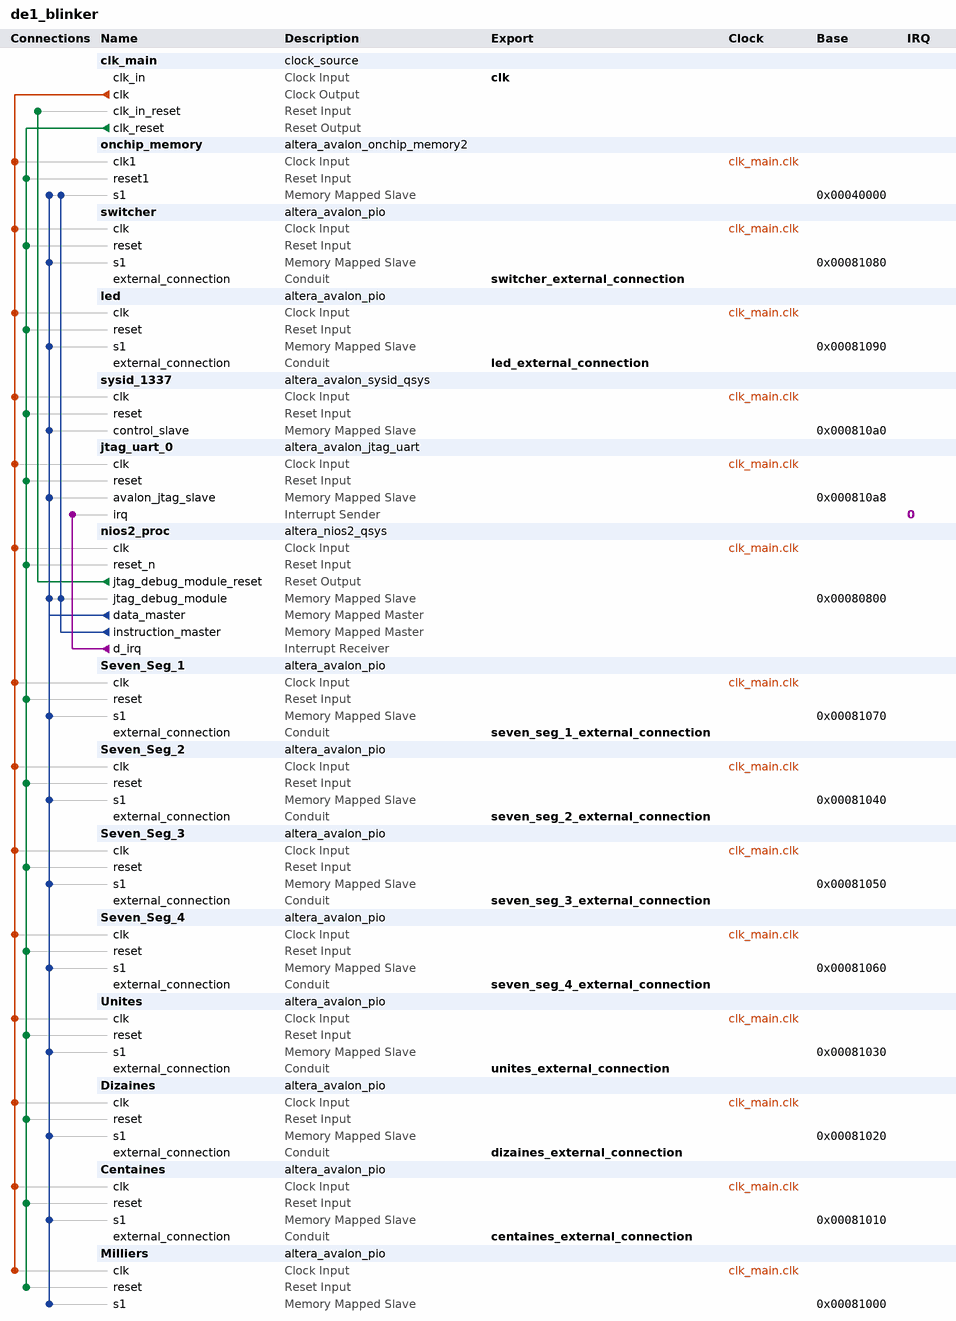
[diagram p0: system contents]
# Platform Designer (Qsys) system de1_blinker, Cyclone V 5CSEBA6U23I7
# Parameters at their usual value, and those the tool derives, are not listed.
package require -exact qsys 15.0
create_system de1_blinker
set_project_property DEVICE_FAMILY {Cyclone V}
set_project_property DEVICE 5CSEBA6U23I7

add_instance clk_main clock_source 15.0
set_instance_parameter_value clk_main clockFrequency 50000000

add_instance onchip_memory altera_avalon_onchip_memory2 15.0
set_instance_parameter_value onchip_memory dataWidth 32
set_instance_parameter_value onchip_memory dualPort false
set_instance_parameter_value onchip_memory initMemContent true
set_instance_parameter_value onchip_memory initializationFileName onchip_mem.hex
set_instance_parameter_value onchip_memory memorySize 200000

add_instance switcher altera_avalon_pio 15.0
set_instance_parameter_value switcher direction Input
set_instance_parameter_value switcher width 4

add_instance led altera_avalon_pio 15.0
set_instance_parameter_value led direction Output
set_instance_parameter_value led width 8

add_instance sysid_1337 altera_avalon_sysid_qsys 15.0
set_instance_parameter_value sysid_1337 id 4919

add_instance jtag_uart_0 altera_avalon_jtag_uart 15.0
set_instance_parameter_value jtag_uart_0 simInteractiveOptions NO_INTERACTIVE_WINDOWS

add_instance nios2_proc altera_nios2_qsys 15.0
set_instance_parameter_value nios2_proc breakSlave nios2_proc.jtag_debug_module
set_instance_parameter_value nios2_proc exceptionSlave onchip_memory.s1
set_instance_parameter_value nios2_proc icache_size 4096
set_instance_parameter_value nios2_proc impl Tiny
set_instance_parameter_value nios2_proc mmu_TLBMissExcSlave None
set_instance_parameter_value nios2_proc resetSlave onchip_memory.s1
set_instance_parameter_value nios2_proc resetrequest_enabled true

add_instance Seven_Seg_1 altera_avalon_pio 15.0
set_instance_parameter_value Seven_Seg_1 direction Output
set_instance_parameter_value Seven_Seg_1 width 8

add_instance Seven_Seg_2 altera_avalon_pio 15.0
set_instance_parameter_value Seven_Seg_2 direction Output
set_instance_parameter_value Seven_Seg_2 width 8

add_instance Seven_Seg_3 altera_avalon_pio 15.0
set_instance_parameter_value Seven_Seg_3 direction Output
set_instance_parameter_value Seven_Seg_3 width 8

add_instance Seven_Seg_4 altera_avalon_pio 15.0
set_instance_parameter_value Seven_Seg_4 direction Output
set_instance_parameter_value Seven_Seg_4 width 8

add_instance Unites altera_avalon_pio 15.0
set_instance_parameter_value Unites direction Input
set_instance_parameter_value Unites width 4

add_instance Dizaines altera_avalon_pio 15.0
set_instance_parameter_value Dizaines direction Input
set_instance_parameter_value Dizaines width 4

add_instance Centaines altera_avalon_pio 15.0
set_instance_parameter_value Centaines direction Input
set_instance_parameter_value Centaines width 4

add_instance Milliers altera_avalon_pio 15.0
set_instance_parameter_value Milliers direction Input
set_instance_parameter_value Milliers width 4

# connections
add_connection clk_main.clk Centaines.clk clock
add_connection clk_main.clk Dizaines.clk clock
add_connection clk_main.clk jtag_uart_0.clk clock
add_connection clk_main.clk led.clk clock
add_connection clk_main.clk Milliers.clk clock
add_connection clk_main.clk nios2_proc.clk clock
add_connection clk_main.clk onchip_memory.clk1 clock
add_connection clk_main.clk Seven_Seg_1.clk clock
add_connection clk_main.clk Seven_Seg_2.clk clock
add_connection clk_main.clk Seven_Seg_3.clk clock
add_connection clk_main.clk Seven_Seg_4.clk clock
add_connection clk_main.clk switcher.clk clock
add_connection clk_main.clk sysid_1337.clk clock
add_connection clk_main.clk Unites.clk clock
add_connection clk_main.clk_reset Centaines.reset reset
add_connection clk_main.clk_reset Dizaines.reset reset
add_connection clk_main.clk_reset jtag_uart_0.reset reset
add_connection clk_main.clk_reset led.reset reset
add_connection clk_main.clk_reset Milliers.reset reset
add_connection clk_main.clk_reset nios2_proc.reset_n reset
add_connection clk_main.clk_reset onchip_memory.reset1 reset
add_connection clk_main.clk_reset Seven_Seg_1.reset reset
add_connection clk_main.clk_reset Seven_Seg_2.reset reset
add_connection clk_main.clk_reset Seven_Seg_3.reset reset
add_connection clk_main.clk_reset Seven_Seg_4.reset reset
add_connection clk_main.clk_reset switcher.reset reset
add_connection clk_main.clk_reset sysid_1337.reset reset
add_connection clk_main.clk_reset Unites.reset reset
add_connection nios2_proc.jtag_debug_module_reset clk_main.clk_in_reset reset
add_connection nios2_proc.data_master Centaines.s1 avalon
set_connection_parameter_value nios2_proc.data_master/Centaines.s1 baseAddress 0x00081010
add_connection nios2_proc.data_master Dizaines.s1 avalon
set_connection_parameter_value nios2_proc.data_master/Dizaines.s1 baseAddress 0x00081020
add_connection nios2_proc.data_master jtag_uart_0.avalon_jtag_slave avalon
set_connection_parameter_value nios2_proc.data_master/jtag_uart_0.avalon_jtag_slave baseAddress 0x000810a8
add_connection nios2_proc.data_master led.s1 avalon
set_connection_parameter_value nios2_proc.data_master/led.s1 baseAddress 0x00081090
add_connection nios2_proc.data_master Milliers.s1 avalon
set_connection_parameter_value nios2_proc.data_master/Milliers.s1 baseAddress 0x00081000
add_connection nios2_proc.data_master nios2_proc.jtag_debug_module avalon
set_connection_parameter_value nios2_proc.data_master/nios2_proc.jtag_debug_module baseAddress 0x00080800
add_connection nios2_proc.data_master onchip_memory.s1 avalon
set_connection_parameter_value nios2_proc.data_master/onchip_memory.s1 baseAddress 0x00040000
add_connection nios2_proc.data_master Seven_Seg_1.s1 avalon
set_connection_parameter_value nios2_proc.data_master/Seven_Seg_1.s1 baseAddress 0x00081070
add_connection nios2_proc.data_master Seven_Seg_2.s1 avalon
set_connection_parameter_value nios2_proc.data_master/Seven_Seg_2.s1 baseAddress 0x00081040
add_connection nios2_proc.data_master Seven_Seg_3.s1 avalon
set_connection_parameter_value nios2_proc.data_master/Seven_Seg_3.s1 baseAddress 0x00081050
add_connection nios2_proc.data_master Seven_Seg_4.s1 avalon
set_connection_parameter_value nios2_proc.data_master/Seven_Seg_4.s1 baseAddress 0x00081060
add_connection nios2_proc.data_master switcher.s1 avalon
set_connection_parameter_value nios2_proc.data_master/switcher.s1 baseAddress 0x00081080
add_connection nios2_proc.data_master sysid_1337.control_slave avalon
set_connection_parameter_value nios2_proc.data_master/sysid_1337.control_slave baseAddress 0x000810a0
add_connection nios2_proc.data_master Unites.s1 avalon
set_connection_parameter_value nios2_proc.data_master/Unites.s1 baseAddress 0x00081030
add_connection nios2_proc.instruction_master nios2_proc.jtag_debug_module avalon
set_connection_parameter_value nios2_proc.instruction_master/nios2_proc.jtag_debug_module baseAddress 0x00080800
add_connection nios2_proc.instruction_master onchip_memory.s1 avalon
set_connection_parameter_value nios2_proc.instruction_master/onchip_memory.s1 baseAddress 0x00040000
add_connection nios2_proc.d_irq jtag_uart_0.irq interrupt
set_connection_parameter_value nios2_proc.d_irq/jtag_uart_0.irq irqNumber 0

# exported interfaces
add_interface centaines_external_connection conduit end
set_interface_property centaines_external_connection EXPORT_OF Centaines.external_connection
add_interface clk clock sink
set_interface_property clk EXPORT_OF clk_main.clk_in
add_interface dizaines_external_connection conduit end
set_interface_property dizaines_external_connection EXPORT_OF Dizaines.external_connection
add_interface led_external_connection conduit end
set_interface_property led_external_connection EXPORT_OF led.external_connection
add_interface seven_seg_1_external_connection conduit end
set_interface_property seven_seg_1_external_connection EXPORT_OF Seven_Seg_1.external_connection
add_interface seven_seg_2_external_connection conduit end
set_interface_property seven_seg_2_external_connection EXPORT_OF Seven_Seg_2.external_connection
add_interface seven_seg_3_external_connection conduit end
set_interface_property seven_seg_3_external_connection EXPORT_OF Seven_Seg_3.external_connection
add_interface seven_seg_4_external_connection conduit end
set_interface_property seven_seg_4_external_connection EXPORT_OF Seven_Seg_4.external_connection
add_interface switcher_external_connection conduit end
set_interface_property switcher_external_connection EXPORT_OF switcher.external_connection
add_interface unites_external_connection conduit end
set_interface_property unites_external_connection EXPORT_OF Unites.external_connection

set_interconnect_requirement {$system} qsys_mm.clockCrossingAdapter HANDSHAKE
set_interconnect_requirement {$system} qsys_mm.enableEccProtection FALSE
set_interconnect_requirement {$system} qsys_mm.insertDefaultSlave FALSE
set_interconnect_requirement {$system} qsys_mm.maxAdditionalLatency 1

save_system de1_blinker.qsys
